# Altium project SCH16T_IMU.PrjPcb
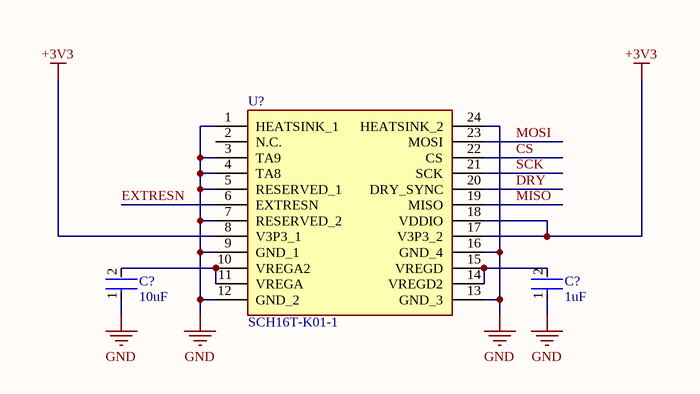
[diagram p0: MAIN.SchDoc]
1 sheet, 3 parts. Net scope: global (net labels, ports and power ports of the same name join across sheets).

## Sheet MAIN.SchDoc
size A; SheetNumber: 1; SheetTotal: 1

### Parts
(Parts that share a designator on the sheet are numbered #1, #2 ... from top to bottom, then left to right.)
C?#1  Capacitance: 10uF  [FP-C1608-080-IPC_A]  (hidden comment: C1608X5R1E106M080AC)
C?#2  Capacitance: 1uF  [FP-C1005-050-0_05-IPC_B]  (hidden comment: C1005X5R1E105K050BC)
U?  SCH16T-K01-1  [SCH16TK011]

### Nets
+3V3: U?.8(V3P3_1) U?.17(V3P3_2) U?.18(VDDIO)
GND: C?#1.1 C?#2.1 U?.1(HEATSINK_1) U?.3(TA9) U?.4(TA8) U?.5(RESERVED_1) U?.7(RESERVED_2) U?.9(GND_1) U?.12(GND_2) U?.13(GND_3) U?.16(GND_4) U?.24(HEATSINK_2)
CS: U?.22(CS)
DRY: U?.20(DRY_SYNC)
EXTRESN: U?.6(EXTRESN)
MISO: U?.19(MISO)
MOSI: U?.23(MOSI)
SCK: U?.21(SCK)
NetC?#1_2: C?#1.2 U?.10(VREGA2) U?.11(VREGA)
NetC?#2_2: C?#2.2 U?.14(VREGD2) U?.15(VREGD)

Not connected (* = marked no-connect by the designer): U? 2(N.C.)

### Library data of the parts
C?#1 = CMP-2000-05442-2: CAP CER 10UF 25V X5R 0603; Dielectric Material: Ceramic; Tolerance: 20%; Dielectric: X5R; Length: 1.6mm; Termination: SMD/SMT; Depth: 0.8mm; RoHS Compliant: Yes; Construction: Flat; Weight: 7.1E-05oz; Thickness: 0.039inch; Packaging: Tape and Reel; Min Operating Temperature: -55°C; Case Code (Imperial): 0603; Case/Package: 0603; Height: 0.8mm; Case Code (Metric): 1608; Voltage Rating: 25V; Resistor Type: Ceramic; Voltage Rating (DC): 25V; Max Operating Temperature: 85°C; REACH SVHC: No SVHC; Lead Free: Lead Free; Series: C; Width: 0.8mm; Mount: Surface Mount; Package Quantity: 1
C?#2 = CMP-2000-06001-2: Multilayer Ceramic Capacitors 1μF ±10% 25V X5R SMD 0402; Package Quantity: 1; Radiation Hardening: No; Dielectric: X5R; REACH SVHC: No SVHC; RoHS Compliant: Yes; Case Code (Imperial): 0402; Voltage Rating: 25V; Termination: SMD/SMT; Max Operating Temperature: 85°C; Series: C; Packaging: Tape and Reel; Tolerance: 10%; Voltage Rating (DC): 25V; Weight: 2.3E-05oz; Height: 0.5mm; Resistor Type: Ceramic; Thickness: 0.022inch; Min Operating Temperature: -55°C; Length: 1mm; Lead Free: Lead Free; Depth: 0.5mm; Dielectric Material: Ceramic; Width: 0.02inch; Case/Package: 0402; Case Code (Metric): 1005; Mount: Surface Mount
U? = SCH16T-K01-1: Undefined or Miscellaneous; Manufacturer_Name: Murata Electronics; Datasheet Link: https://www.murata.com/-/media/webrenewal/products/sensor/pdf/datasheet/datasheet-sch16t-series-short.ashx?la=en-us&cvid=20240110024121000000; Height: 3mm; Manufacturer_Part_Number: SCH16T-K01-1; Mouser Part Number: 81-SCH16T-K01-1; Mouser Price/Stock: https://www.mouser.co.uk/ProductDetail/Murata-Electronics/SCH16T-K01-1?qs=HFfMDpzxxd0hctvcENbFhg%3D%3D; Arrow Part Number: SCH16T-K01-1; Arrow Price/Stock: https://www.arrow.com/en/products/sch16t-k01-1/murata-manufacturing?utm_currency=USD&region=nac